# EAGLE schematic RIO_V0 (EAGLE 6.4)
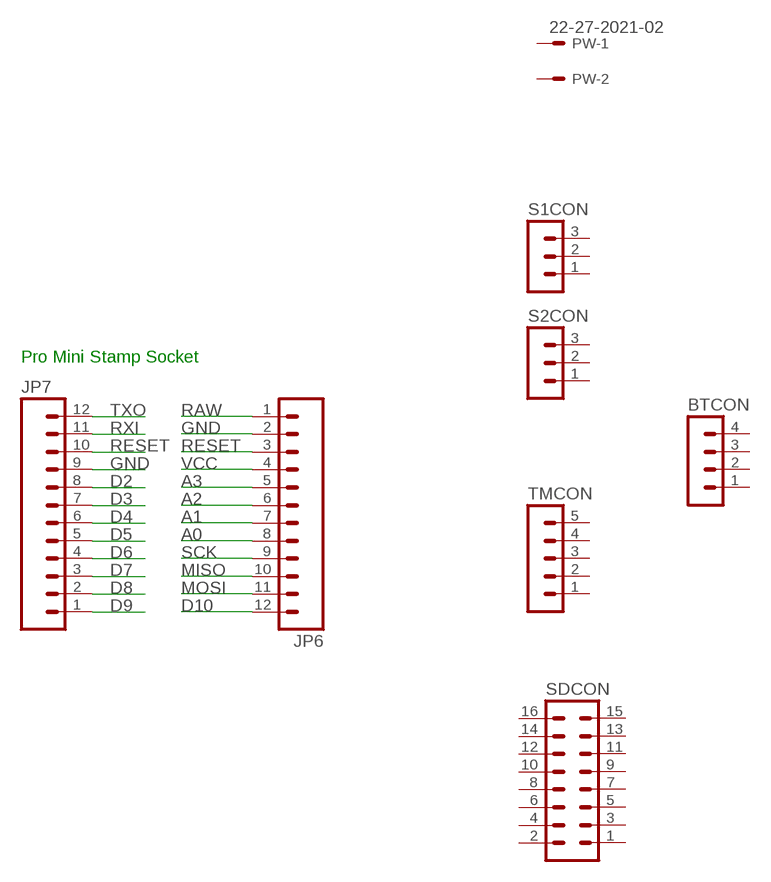
[diagram p0: schematic, sheet 1]

## Parts
BTCON  MA04-1  [MA04-1]
JP6  M12PTH  [1X12]
JP7  M12PTH  [1X12]
PW  22-27-2021-02  [6410-02]
S1CON  MA03-1  [MA03-1]
S2CON  MA03-1  [MA03-1]
SDCON  MA08-2  [MA08-2]
TMCON  MA05-1  [MA05-1]

## Nets
A0: JP6.8
A1: JP6.7
A2: JP6.6
A3: JP6.5
D2: JP7.8
D3: JP7.7
D4: JP7.6
D5: JP7.5
D6: JP7.4
D7: JP7.3
D8: JP7.2
D9: JP7.1
D10: JP6.12
GND: JP6.2 JP7.9
MISO: JP6.10
MOSI: JP6.11
RAW [v]: JP6.1
RESET: JP6.3 JP7.10
RXI: JP7.11
SCK: JP6.9
TXO: JP7.12
VCC: JP6.4
Unconnected: BTCON.1 BTCON.2 BTCON.3 BTCON.4 PW.1 PW.2 S1CON.1 S1CON.2 S1CON.3 S2CON.1 S2CON.2 S2CON.3 SDCON.1 SDCON.2 SDCON.3 SDCON.4 SDCON.5 SDCON.6 SDCON.7 SDCON.8 SDCON.9 SDCON.10 SDCON.11 SDCON.12 SDCON.13 SDCON.14 SDCON.15 SDCON.16 TMCON.1 TMCON.2 TMCON.3 TMCON.4 TMCON.5

## Notes on the sheet
- Pro Mini Stamp Socket

## Library data of the parts
BTCON = con-lstb:MA04-1: PIN HEADER; OC_FARNELL: unknown; OC_NEWARK: unknown
JP6 JP7 = SparkFun:M12: Header 12 Standard 12-pin 0.1" header. Use with straight break away headers (SKU : PRT-00116), right angle break away headers (PRT-00553), swiss pins (PRT-00743), machine pins (PRT-00117), and female headers (PRT-00115).
PW = con-molex:22-?-02: CONNECTOR wire to board 2.54 mm (.1 inch) pitch header; OC_FARNELL: unknown; OC_NEWARK: unknown
S1CON S2CON = con-lstb:MA03-1: PIN HEADER; OC_FARNELL: unknown; OC_NEWARK: unknown
SDCON = con-lstb:MA08-2: PIN HEADER; OC_FARNELL: unknown; OC_NEWARK: unknown
TMCON = con-lstb:MA05-1: PIN HEADER; OC_FARNELL: unknown; OC_NEWARK: unknown

## Net classes
0 default: width 0.3 mm, drill 0.5 mm, clearance 0.25 mm